# Altium schematic sheet PHY.SchDoc
size A4; SheetNumber: 8; SheetTotal: 9
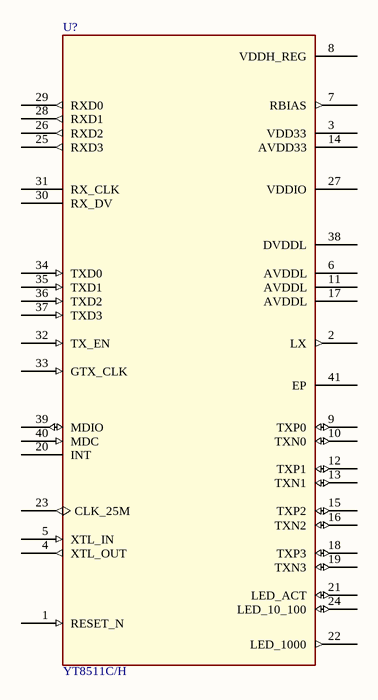
[diagram p0: PHY.SchDoc]

## Parts
U?  YT8511C/H  [QFN40 5X5_N]

## Nets

Not connected (* = marked no-connect by the designer): U? 1(RESET_N) 2(LX) 3(VDD33) 4(XTL_OUT) 5(XTL_IN) 6(AVDDL) 7(RBIAS) 8(VDDH_REG) 9(TXP0) 10(TXN0) 11(AVDDL) 12(TXP1) 13(TXN1) 14(AVDD33) 15(TXP2) 16(TXN2) 17(AVDDL) 18(TXP3) 19(TXN3) 20(INT) 21(LED_ACT) 22(LED_1000) 23(CLK_25M) 24(LED_10_100) 25(RXD3) 26(RXD2) 27(VDDIO) 28(RXD1) 29(RXD0) 30(RX_DV) 31(RX_CLK) 32(TX_EN) 33(GTX_CLK) 34(TXD0) 35(TXD1) 36(TXD2) 37(TXD3) 38(DVDDL) 39(MDIO) 40(MDC) 41(EP)

## Library data of the parts
U? = YT8511C/H: 千兆以太网PHY